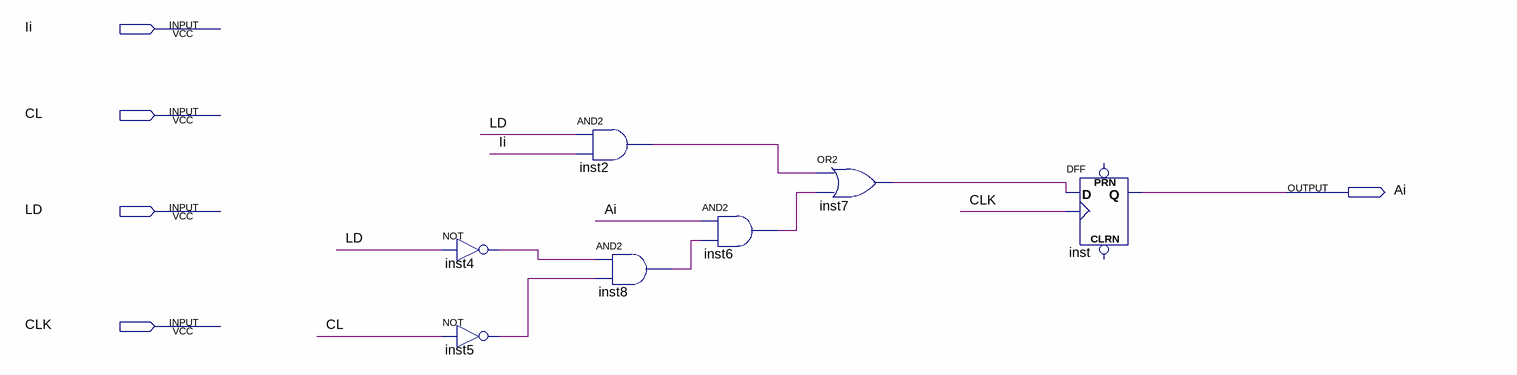
[diagram p0: schematic sheet]
// Quartus schematic REG1_LD_CL.bdf as structural Verilog: 7 symbols, 5 pins
module REG1_LD_CL (
  input  Ii,
  input  CL,
  input  LD,
  input  CLK,
  output Ai
);

  wire inst2_out, inst4_out, inst5_out, inst6_out, inst7_out, inst8_out;

  not inst4 (inst4_out, LD);
  not inst5 (inst5_out, CL);
  and inst2 (inst2_out, LD, Ii);
  and inst8 (inst8_out, inst4_out, inst5_out);
  and inst6 (inst6_out, Ai, inst8_out);
  or inst7 (inst7_out, inst2_out, inst6_out);
  DFF inst (.CLK(CLK), .D(inst7_out), .Q(Ai));  // open: CLRN, PRN
endmodule
